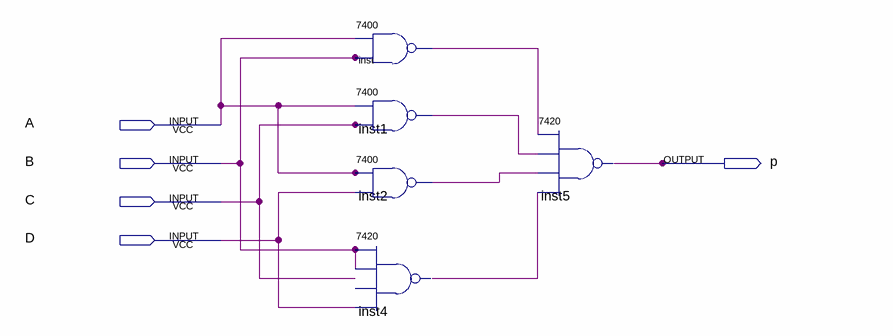
[diagram p0: schematic sheet]
// Quartus schematic 41.bdf as structural Verilog: 5 symbols, 5 pins
module \41  (
  input  A,
  input  B,
  input  C,
  input  D,
  output p
);

  wire inst1_1, inst2_1, inst4_1, inst_1;

  \7400  inst (.\3 (B), .\2 (A), .\1 (inst_1));
  \7400  inst1 (.\3 (C), .\2 (A), .\1 (inst1_1));
  \7400  inst2 (.\3 (D), .\2 (A), .\1 (inst2_1));
  \7420  inst4 (.\2 (B), .\3 (B), .\5 (D), .\1 (inst4_1));  // open: 4
  \7420  inst5 (.\4 (inst2_1), .\2 (inst_1), .\3 (inst1_1), .\5 (inst4_1), .\1 (p));
endmodule
